# EAGLE schematic bed_prod (EAGLE 9.5.0)

## Sheet 1 of 2
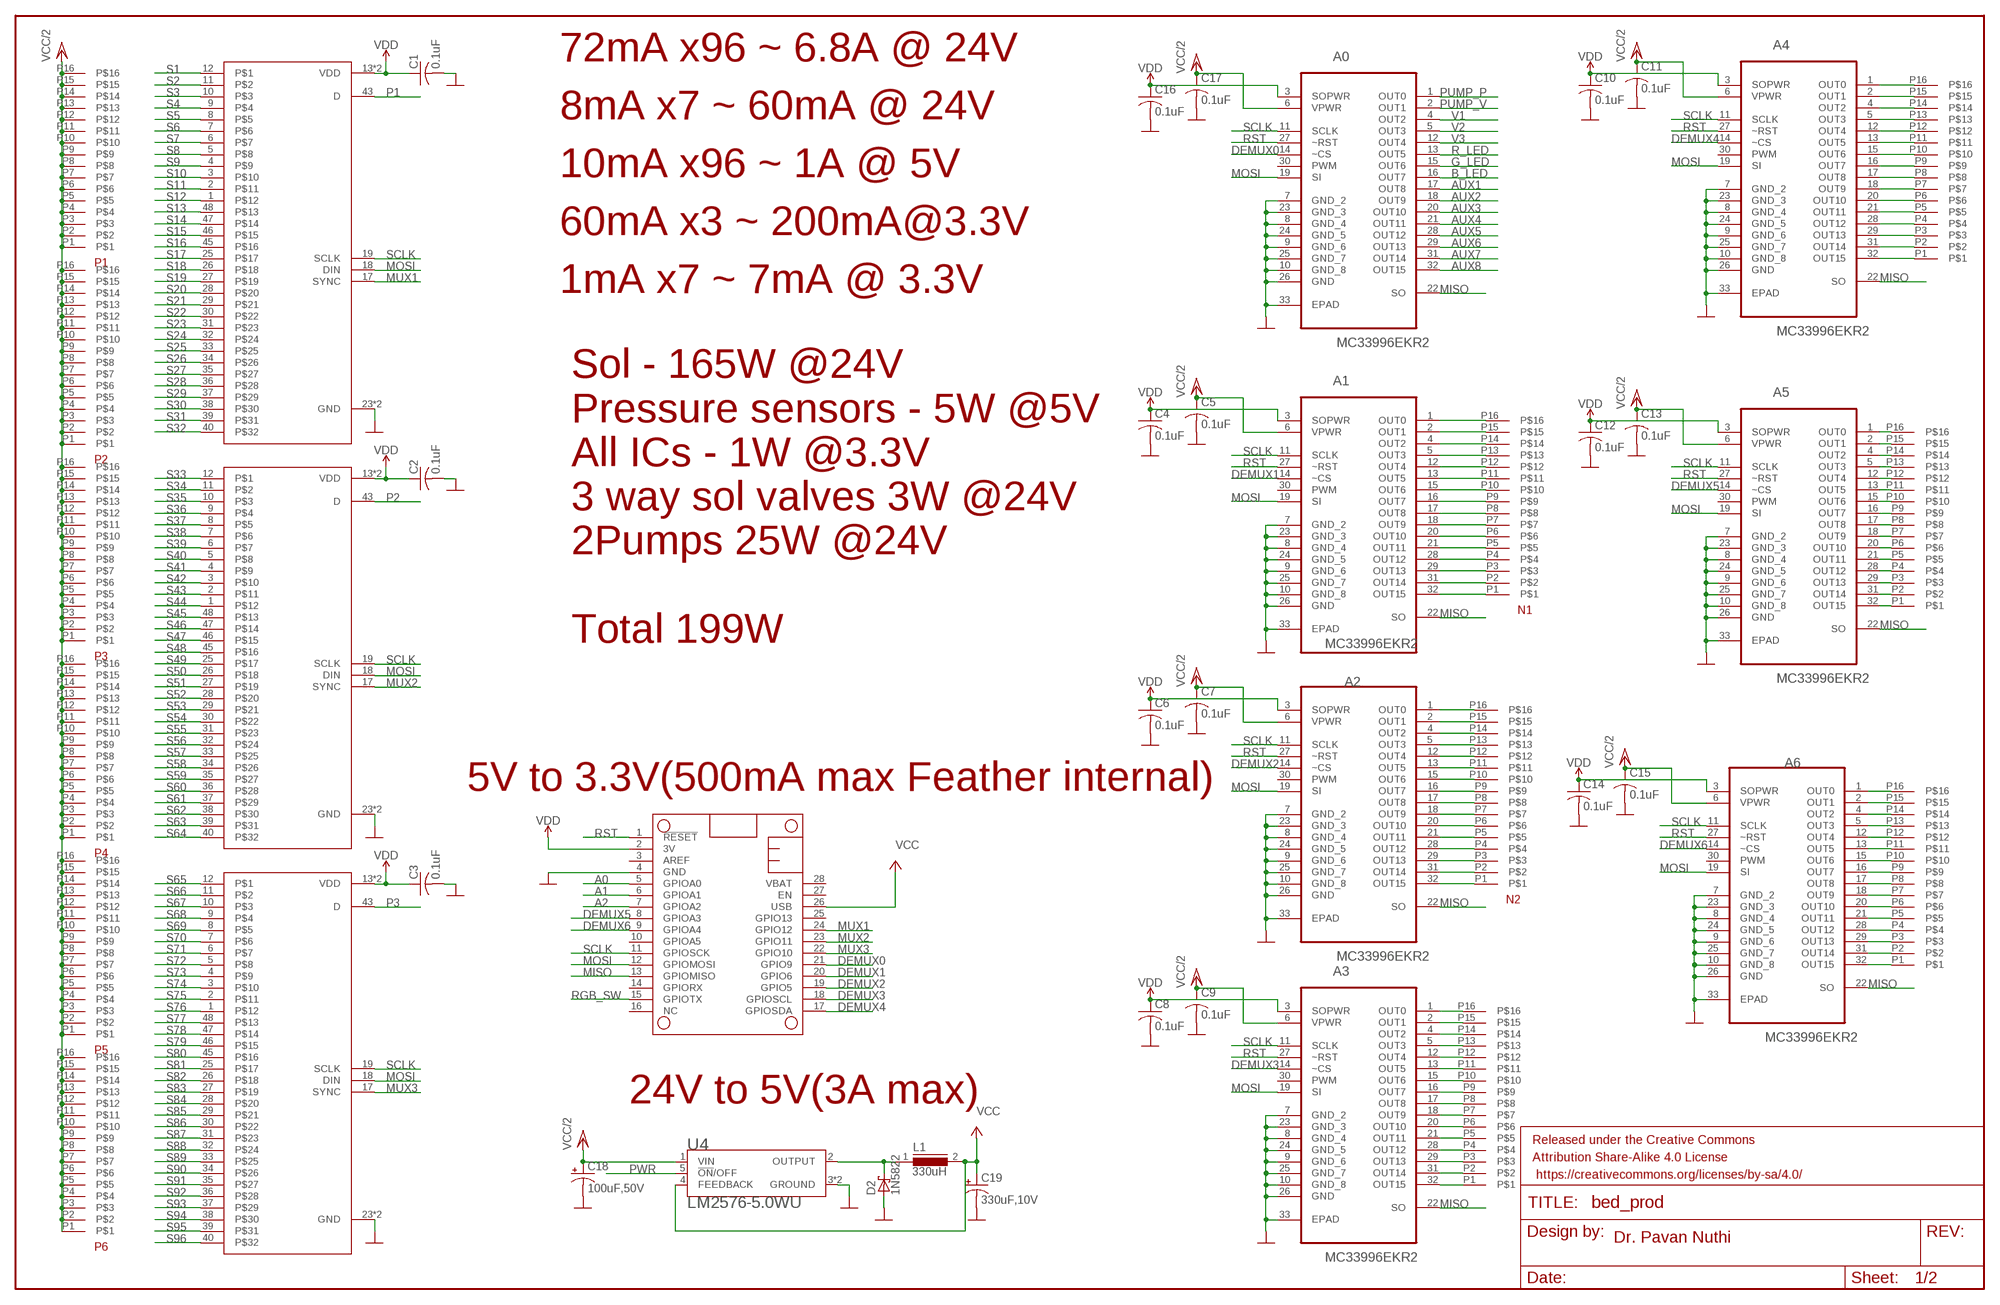
[diagram p0: schematic, sheet 1, part 1 of 2]
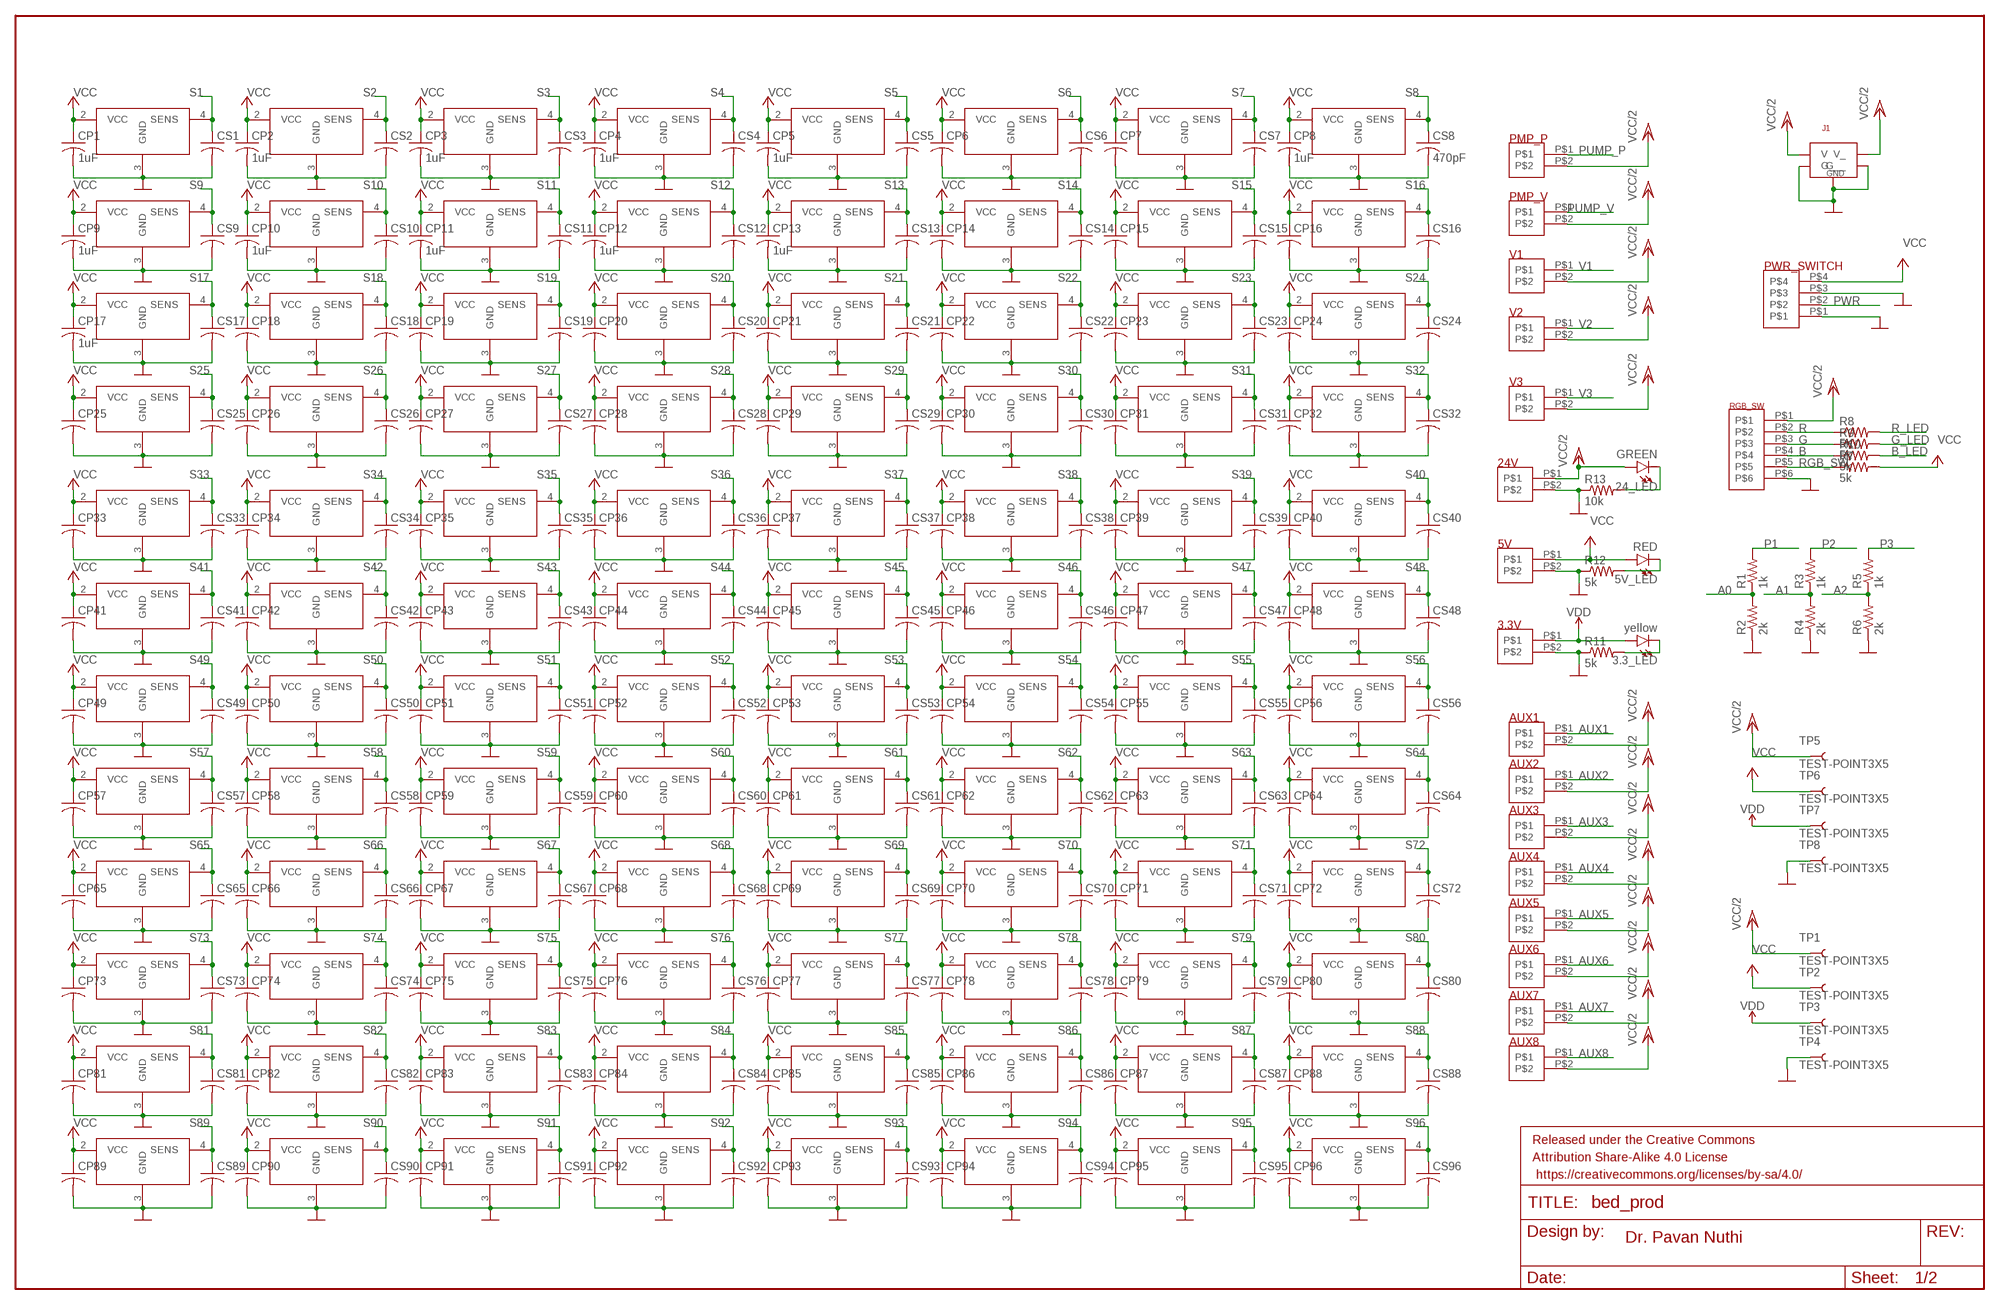
[diagram p1: schematic, sheet 1, part 2 of 2]

### Parts
3.3_LED  yellow  LED1206  [LED-1206]
3.3V  2CONN_2MM  [2CONN_2MM]
5V  2CONN_2MM  [2CONN_2MM]
5V_LED  RED  LED-RED1206  [LED-1206]
24_LED  GREEN  LED-GREEN1206  [LED-1206]
24V  2CONN_2MM  [2CONN_2MM]
A0  MC33996EKR2  [SOIC65P1030X265-32N]
A1  MC33996EKR2  [SOIC65P1030X265-32N]
A2  MC33996EKR2  [SOIC65P1030X265-32N]
A3  MC33996EKR2  [SOIC65P1030X265-32N]
A4  MC33996EKR2  [SOIC65P1030X265-32N]
A5  MC33996EKR2  [SOIC65P1030X265-32N]
A6  MC33996EKR2  [SOIC65P1030X265-32N]
AUX1  2CONN_2MM  [2CONN_2MM]
AUX2  2CONN_2MM  [2CONN_2MM]
AUX3  2CONN_2MM  [2CONN_2MM]
AUX4  2CONN_2MM  [2CONN_2MM]
AUX5  2CONN_2MM  [2CONN_2MM]
AUX6  2CONN_2MM  [2CONN_2MM]
AUX7  2CONN_2MM  [2CONN_2MM]
AUX8  2CONN_2MM  [2CONN_2MM]
C1  0.1uF  C-USC1206  [C1206]
C2  0.1uF  C-USC1206  [C1206]
C3  0.1uF  C-USC1206  [C1206]
C4  0.1uF  C-USC1206  [C1206]
C5  0.1uF  C-USC1206  [C1206]
C6  0.1uF  C-USC1206  [C1206]
C7  0.1uF  C-USC1206  [C1206]
C8  0.1uF  C-USC1206  [C1206]
C9  0.1uF  C-USC1206  [C1206]
C10  0.1uF  C-USC1206  [C1206]
C11  0.1uF  C-USC1206  [C1206]
C12  0.1uF  C-USC1206  [C1206]
C13  0.1uF  C-USC1206  [C1206]
C14  0.1uF  C-USC1206  [C1206]
C15  0.1uF  C-USC1206  [C1206]
C16  0.1uF  C-USC1206  [C1206]
C17  0.1uF  C-USC1206  [C1206]
C18  100uF,50V  CPOL-USE3.5-8  [E3,5-8]
C19  330uF,10V  CPOL-USE3.5-8  [E3,5-8]
CP1  1uF  C-USC1206  [C1206]
CP2  1uF  C-USC1206  [C1206]
CP3  1uF  C-USC1206  [C1206]
CP4  1uF  C-USC1206  [C1206]
CP5  1uF  C-USC1206  [C1206]
CP6  C-USC1206  [C1206]
CP7  C-USC1206  [C1206]
CP8  1uF  C-USC1206  [C1206]
CP9  1uF  C-USC1206  [C1206]
CP10  1uF  C-USC1206  [C1206]
CP11  1uF  C-USC1206  [C1206]
CP12  1uF  C-USC1206  [C1206]
CP13  1uF  C-USC1206  [C1206]
CP14  C-USC1206  [C1206]
CP15  C-USC1206  [C1206]
CP16  C-USC1206  [C1206]
CP17  1uF  C-USC1206  [C1206]
CP18  C-USC1206  [C1206]
CP19  C-USC1206  [C1206]
CP20  C-USC1206  [C1206]
CP21  C-USC1206  [C1206]
CP22  C-USC1206  [C1206]
CP23  C-USC1206  [C1206]
CP24  C-USC1206  [C1206]
CP25  C-USC1206  [C1206]
CP26  C-USC1206  [C1206]
CP27  C-USC1206  [C1206]
CP28  C-USC1206  [C1206]
CP29  C-USC1206  [C1206]
CP30  C-USC1206  [C1206]
CP31  C-USC1206  [C1206]
CP32  C-USC1206  [C1206]
CP33  C-USC1206  [C1206]
CP34  C-USC1206  [C1206]
CP35  C-USC1206  [C1206]
CP36  C-USC1206  [C1206]
CP37  C-USC1206  [C1206]
CP38  C-USC1206  [C1206]
CP39  C-USC1206  [C1206]
CP40  C-USC1206  [C1206]
CP41  C-USC1206  [C1206]
CP42  C-USC1206  [C1206]
CP43  C-USC1206  [C1206]
CP44  C-USC1206  [C1206]
CP45  C-USC1206  [C1206]
CP46  C-USC1206  [C1206]
CP47  C-USC1206  [C1206]
CP48  C-USC1206  [C1206]
CP49  C-USC1206  [C1206]
CP50  C-USC1206  [C1206]
CP51  C-USC1206  [C1206]
CP52  C-USC1206  [C1206]
CP53  C-USC1206  [C1206]
CP54  C-USC1206  [C1206]
CP55  C-USC1206  [C1206]
CP56  C-USC1206  [C1206]
CP57  C-USC1206  [C1206]
CP58  C-USC1206  [C1206]
CP59  C-USC1206  [C1206]
CP60  C-USC1206  [C1206]
CP61  C-USC1206  [C1206]
CP62  C-USC1206  [C1206]
CP63  C-USC1206  [C1206]
CP64  C-USC1206  [C1206]
CP65  C-USC1206  [C1206]
CP66  C-USC1206  [C1206]
CP67  C-USC1206  [C1206]
CP68  C-USC1206  [C1206]
CP69  C-USC1206  [C1206]
CP70  C-USC1206  [C1206]
CP71  C-USC1206  [C1206]
CP72  C-USC1206  [C1206]
CP73  C-USC1206  [C1206]
CP74  C-USC1206  [C1206]
CP75  C-USC1206  [C1206]
CP76  C-USC1206  [C1206]
CP77  C-USC1206  [C1206]
CP78  C-USC1206  [C1206]
CP79  C-USC1206  [C1206]
CP80  C-USC1206  [C1206]
CP81  C-USC1206  [C1206]
CP82  C-USC1206  [C1206]
CP83  C-USC1206  [C1206]
CP84  C-USC1206  [C1206]
CP85  C-USC1206  [C1206]
CP86  C-USC1206  [C1206]
CP87  C-USC1206  [C1206]
CP88  C-USC1206  [C1206]
CP89  C-USC1206  [C1206]
CP90  C-USC1206  [C1206]
CP91  C-USC1206  [C1206]
CP92  C-USC1206  [C1206]
CP93  C-USC1206  [C1206]
CP94  C-USC1206  [C1206]
CP95  C-USC1206  [C1206]
CP96  C-USC1206  [C1206]
CS1  C-USC1206  [C1206]
CS2  C-USC1206  [C1206]
CS3  C-USC1206  [C1206]
CS4  C-USC1206  [C1206]
CS5  C-USC1206  [C1206]
CS6  C-USC1206  [C1206]
CS7  C-USC1206  [C1206]
CS8  470pF  C-USC1206  [C1206]
CS9  C-USC1206  [C1206]
CS10  C-USC1206  [C1206]
CS11  C-USC1206  [C1206]
CS12  C-USC1206  [C1206]
CS13  C-USC1206  [C1206]
CS14  C-USC1206  [C1206]
CS15  C-USC1206  [C1206]
CS16  C-USC1206  [C1206]
CS17  C-USC1206  [C1206]
CS18  C-USC1206  [C1206]
CS19  C-USC1206  [C1206]
CS20  C-USC1206  [C1206]
CS21  C-USC1206  [C1206]
CS22  C-USC1206  [C1206]
CS23  C-USC1206  [C1206]
CS24  C-USC1206  [C1206]
CS25  C-USC1206  [C1206]
CS26  C-USC1206  [C1206]
CS27  C-USC1206  [C1206]
CS28  C-USC1206  [C1206]
CS29  C-USC1206  [C1206]
CS30  C-USC1206  [C1206]
CS31  C-USC1206  [C1206]
CS32  C-USC1206  [C1206]
CS33  C-USC1206  [C1206]
CS34  C-USC1206  [C1206]
CS35  C-USC1206  [C1206]
CS36  C-USC1206  [C1206]
CS37  C-USC1206  [C1206]
CS38  C-USC1206  [C1206]
CS39  C-USC1206  [C1206]
CS40  C-USC1206  [C1206]
CS41  C-USC1206  [C1206]
CS42  C-USC1206  [C1206]
CS43  C-USC1206  [C1206]
CS44  C-USC1206  [C1206]
CS45  C-USC1206  [C1206]
CS46  C-USC1206  [C1206]
CS47  C-USC1206  [C1206]
CS48  C-USC1206  [C1206]
CS49  C-USC1206  [C1206]
CS50  C-USC1206  [C1206]
CS51  C-USC1206  [C1206]
CS52  C-USC1206  [C1206]
CS53  C-USC1206  [C1206]
CS54  C-USC1206  [C1206]
CS55  C-USC1206  [C1206]
CS56  C-USC1206  [C1206]
CS57  C-USC1206  [C1206]
CS58  C-USC1206  [C1206]
CS59  C-USC1206  [C1206]
CS60  C-USC1206  [C1206]
CS61  C-USC1206  [C1206]
CS62  C-USC1206  [C1206]
CS63  C-USC1206  [C1206]
CS64  C-USC1206  [C1206]
CS65  C-USC1206  [C1206]
CS66  C-USC1206  [C1206]
CS67  C-USC1206  [C1206]
CS68  C-USC1206  [C1206]
CS69  C-USC1206  [C1206]
CS70  C-USC1206  [C1206]
CS71  C-USC1206  [C1206]
CS72  C-USC1206  [C1206]
CS73  C-USC1206  [C1206]
CS74  C-USC1206  [C1206]
CS75  C-USC1206  [C1206]
CS76  C-USC1206  [C1206]
CS77  C-USC1206  [C1206]
CS78  C-USC1206  [C1206]
CS79  C-USC1206  [C1206]
CS80  C-USC1206  [C1206]
CS81  C-USC1206  [C1206]
CS82  C-USC1206  [C1206]
CS83  C-USC1206  [C1206]
CS84  C-USC1206  [C1206]
CS85  C-USC1206  [C1206]
CS86  C-USC1206  [C1206]
CS87  C-USC1206  [C1206]
CS88  C-USC1206  [C1206]
CS89  C-USC1206  [C1206]
CS90  C-USC1206  [C1206]
CS91  C-USC1206  [C1206]
CS92  C-USC1206  [C1206]
CS93  C-USC1206  [C1206]
CS94  C-USC1206  [C1206]
CS95  C-USC1206  [C1206]
CS96  C-USC1206  [C1206]
D2  1N5822  SCHOTTKY-DIODEDO201T15  [DO201T15]
FRAME1  FRAME-LEDGER  [CREATIVE_COMMONS]
FRAME2  FRAME-LEDGER  [CREATIVE_COMMONS]
J1  KPJX-4S-S  [KYCON-KPXJ-4S]
L1  330uH  DR127  [DR127]
MS1  FEATHERWING_NODIM  [FEATHERWING_DIM]
N1  16CONN_2MM  [16CONN_2MM]
N2  16CONN_2MM  [16CONN_2MM]
N3  16CONN_2MM  [16CONN_2MM]
N4  16CONN_2MM  [16CONN_2MM]
N5  16CONN_2MM  [16CONN_2MM]
N6  16CONN_2MM  [16CONN_2MM]
P1  16CONN_2MM  [16CONN_2MM]
P2  16CONN_2MM  [16CONN_2MM]
P3  16CONN_2MM  [16CONN_2MM]
P4  16CONN_2MM  [16CONN_2MM]
P5  16CONN_2MM  [16CONN_2MM]
P6  16CONN_2MM  [16CONN_2MM]
PMP_P  2CONN_2MM  [2CONN_2MM]
PMP_V  2CONN_2MM  [2CONN_2MM]
PWR_SWITCH  4CONN_2MM  [4CONN_2MM]
R1  1k  R-US_R1206  [R1206]
R2  2k  R-US_R1206  [R1206]
R3  1k  R-US_R1206  [R1206]
R4  2k  R-US_R1206  [R1206]
R5  1k  R-US_R1206  [R1206]
R6  2k  R-US_R1206  [R1206]
R7  5k  R-US_R1206W  [R1206W]
R8  5K  R-US_R1206W  [R1206W]
R9  5k  R-US_R1206W  [R1206W]
R10  5k  R-US_R1206W  [R1206W]
R11  5k  R-US_R1206W  [R1206W]
R12  5k  R-US_R1206W  [R1206W]
R13  10k  R-US_R1206W  [R1206W]
RGB_SW  6CONN_2MM  [6CONN_2MM]
SENS1  MPX5100  [98ASB17759C]
SENS2  MPX5100  [98ASB17759C]
SENS3  MPX5100  [98ASB17759C]
SENS4  MPX5100  [98ASB17759C]
SENS5  MPX5100  [98ASB17759C]
SENS6  MPX5100  [98ASB17759C]
SENS7  MPX5100  [98ASB17759C]
SENS8  MPX5100  [98ASB17759C]
SENS9  MPX5100  [98ASB17759C]
SENS10  MPX5100  [98ASB17759C]
SENS11  MPX5100  [98ASB17759C]
SENS12  MPX5100  [98ASB17759C]
SENS13  MPX5100  [98ASB17759C]
SENS14  MPX5100  [98ASB17759C]
SENS15  MPX5100  [98ASB17759C]
SENS16  MPX5100  [98ASB17759C]
SENS17  MPX5100  [98ASB17759C]
SENS18  MPX5100  [98ASB17759C]
SENS19  MPX5100  [98ASB17759C]
SENS20  MPX5100  [98ASB17759C]
SENS21  MPX5100  [98ASB17759C]
SENS22  MPX5100  [98ASB17759C]
SENS23  MPX5100  [98ASB17759C]
SENS24  MPX5100  [98ASB17759C]
SENS25  MPX5100  [98ASB17759C]
SENS26  MPX5100  [98ASB17759C]
SENS27  MPX5100  [98ASB17759C]
SENS28  MPX5100  [98ASB17759C]
SENS29  MPX5100  [98ASB17759C]
SENS30  MPX5100  [98ASB17759C]
SENS31  MPX5100  [98ASB17759C]
SENS32  MPX5100  [98ASB17759C]
SENS33  MPX5100  [98ASB17759C]
SENS34  MPX5100  [98ASB17759C]
SENS35  MPX5100  [98ASB17759C]
SENS36  MPX5100  [98ASB17759C]
SENS37  MPX5100  [98ASB17759C]
SENS38  MPX5100  [98ASB17759C]
SENS39  MPX5100  [98ASB17759C]
SENS40  MPX5100  [98ASB17759C]
SENS41  MPX5100  [98ASB17759C]
SENS42  MPX5100  [98ASB17759C]
SENS43  MPX5100  [98ASB17759C]
SENS44  MPX5100  [98ASB17759C]
SENS45  MPX5100  [98ASB17759C]
SENS46  MPX5100  [98ASB17759C]
SENS47  MPX5100  [98ASB17759C]
SENS48  MPX5100  [98ASB17759C]
SENS49  MPX5100  [98ASB17759C]
SENS50  MPX5100  [98ASB17759C]
SENS51  MPX5100  [98ASB17759C]
SENS52  MPX5100  [98ASB17759C]
SENS53  MPX5100  [98ASB17759C]
SENS54  MPX5100  [98ASB17759C]
SENS55  MPX5100  [98ASB17759C]
SENS56  MPX5100  [98ASB17759C]
SENS57  MPX5100  [98ASB17759C]
SENS58  MPX5100  [98ASB17759C]
SENS59  MPX5100  [98ASB17759C]
SENS60  MPX5100  [98ASB17759C]
SENS61  MPX5100  [98ASB17759C]
SENS62  MPX5100  [98ASB17759C]
SENS63  MPX5100  [98ASB17759C]
SENS64  MPX5100  [98ASB17759C]
SENS65  MPX5100  [98ASB17759C]
SENS66  MPX5100  [98ASB17759C]
SENS67  MPX5100  [98ASB17759C]
SENS68  MPX5100  [98ASB17759C]
SENS69  MPX5100  [98ASB17759C]
SENS70  MPX5100  [98ASB17759C]
SENS71  MPX5100  [98ASB17759C]
SENS72  MPX5100  [98ASB17759C]
SENS73  MPX5100  [98ASB17759C]
SENS74  MPX5100  [98ASB17759C]
SENS75  MPX5100  [98ASB17759C]
SENS76  MPX5100  [98ASB17759C]
SENS77  MPX5100  [98ASB17759C]
SENS78  MPX5100  [98ASB17759C]
SENS79  MPX5100  [98ASB17759C]
SENS80  MPX5100  [98ASB17759C]
SENS81  MPX5100  [98ASB17759C]
SENS82  MPX5100  [98ASB17759C]
SENS83  MPX5100  [98ASB17759C]
SENS84  MPX5100  [98ASB17759C]
SENS85  MPX5100  [98ASB17759C]
SENS86  MPX5100  [98ASB17759C]
SENS87  MPX5100  [98ASB17759C]
SENS88  MPX5100  [98ASB17759C]
SENS89  MPX5100  [98ASB17759C]
SENS90  MPX5100  [98ASB17759C]
SENS91  MPX5100  [98ASB17759C]
SENS92  MPX5100  [98ASB17759C]
SENS93  MPX5100  [98ASB17759C]
SENS94  MPX5100  [98ASB17759C]
SENS95  MPX5100  [98ASB17759C]
SENS96  MPX5100  [98ASB17759C]
TP1  TEST-POINT3X5  [PAD.03X.05]
TP2  TEST-POINT3X5  [PAD.03X.05]
TP3  TEST-POINT3X5  [PAD.03X.05]
TP4  TEST-POINT3X5  [PAD.03X.05]
TP5  TEST-POINT3X5  [PAD.03X.05]
TP6  TEST-POINT3X5  [PAD.03X.05]
TP7  TEST-POINT3X5  [PAD.03X.05]
TP8  TEST-POINT3X5  [PAD.03X.05]
U1  ADG731  [QFP50P900X900X160-49N]
U2  ADG731  [QFP50P900X900X160-49N]
U3  ADG731  [QFP50P900X900X160-49N]
U4  LM2576-5.0WU  [DPAK6P170_1524X459L254X81N]
V1  2CONN_2MM  [2CONN_2MM]
V2  2CONN_2MM  [2CONN_2MM]
V3  2CONN_2MM  [2CONN_2MM]

### Nets
A0: MS1.5(GPIOA0) R1.1 R2.2
A1: MS1.6(GPIOA1) R3.1 R4.2
A2: MS1.7(GPIOA2) R5.1 R6.2
AUX1: A0.17(OUT8) AUX1.P$1
AUX2: A0.18(OUT9) AUX2.P$1
AUX3: A0.20(OUT10) AUX3.P$1
AUX4: A0.21(OUT11) AUX4.P$1
AUX5: A0.28(OUT12) AUX5.P$1
AUX6: A0.29(OUT13) AUX6.P$1
AUX7: A0.31(OUT14) AUX7.P$1
AUX8: A0.32(OUT15) AUX8.P$1
B: R10.1 RGB_SW.P$4
B_LED: A0.16(OUT7) R10.2
DEMUX0: A0.14(~CS) MS1.21(GPIO9)
DEMUX1: A1.14(~CS) MS1.20(GPIO6)
DEMUX2: A2.14(~CS) MS1.19(GPIO5)
DEMUX3: A3.14(~CS) MS1.18(GPIOSCL)
DEMUX4: A4.14(~CS) MS1.17(GPIOSDA)
DEMUX5: A5.14(~CS) MS1.8(GPIOA3)
DEMUX6: A6.14(~CS) MS1.9(GPIOA4)
G: R9.1 RGB_SW.P$3
G_LED: A0.15(OUT6) R9.2
GND [pwr]: 3.3V.P$2 5V.P$2 24V.P$2 A0.7(GND_2) A0.8(GND_4) A0.9(GND_6) A0.10(GND_8) A0.23(GND_3) A0.24(GND_5) A0.25(GND_7) A0.26(GND) A0.33(EPAD) A1.7(GND_2) A1.8(GND_4) A1.9(GND_6) A1.10(GND_8) A1.23(GND_3) A1.24(GND_5) A1.25(GND_7) A1.26(GND) A1.33(EPAD) A2.7(GND_2) A2.8(GND_4) A2.9(GND_6) A2.10(GND_8) A2.23(GND_3) A2.24(GND_5) A2.25(GND_7) A2.26(GND) A2.33(EPAD) A3.7(GND_2) A3.8(GND_4) A3.9(GND_6) A3.10(GND_8) A3.23(GND_3) A3.24(GND_5) A3.25(GND_7) A3.26(GND) A3.33(EPAD) A4.7(GND_2) A4.8(GND_4) A4.9(GND_6) A4.10(GND_8) A4.23(GND_3) A4.24(GND_5) A4.25(GND_7) A4.26(GND) A4.33(EPAD) A5.7(GND_2) A5.8(GND_4) A5.9(GND_6) A5.10(GND_8) A5.23(GND_3) A5.24(GND_5) A5.25(GND_7) A5.26(GND) A5.33(EPAD) A6.7(GND_2) A6.8(GND_4) A6.9(GND_6) A6.10(GND_8) A6.23(GND_3) A6.24(GND_5) A6.25(GND_7) A6.26(GND) A6.33(EPAD) C1.2 C2.2 C3.2 C4.2 C5.2 C6.2 C7.2 C8.2 C9.2 C10.2 C11.2 C12.2 C13.2 C14.2 C15.2 C16.2 C17.2 C18.- C19.- CP1.2 CP2.2 CP3.2 CP4.2 CP5.2 CP6.2 CP7.2 CP8.2 CP9.2 CP10.2 CP11.2 CP12.2 CP13.2 CP14.2 CP15.2 CP16.2 CP17.2 CP18.2 CP19.2 CP20.2 CP21.2 CP22.2 CP23.2 CP24.2 CP25.2 CP26.2 CP27.2 CP28.2 CP29.2 CP30.2 CP31.2 CP32.2 CP33.2 CP34.2 CP35.2 CP36.2 CP37.2 CP38.2 CP39.2 CP40.2 CP41.2 CP42.2 CP43.2 CP44.2 CP45.2 CP46.2 CP47.2 CP48.2 CP49.2 CP50.2 CP51.2 CP52.2 CP53.2 CP54.2 CP55.2 CP56.2 CP57.2 CP58.2 CP59.2 CP60.2 CP61.2 CP62.2 CP63.2 CP64.2 CP65.2 CP66.2 CP67.2 CP68.2 CP69.2 CP70.2 CP71.2 CP72.2 CP73.2 CP74.2 CP75.2 CP76.2 CP77.2 CP78.2 CP79.2 CP80.2 CP81.2 CP82.2 CP83.2 CP84.2 CP85.2 CP86.2 CP87.2 CP88.2 CP89.2 CP90.2 CP91.2 CP92.2 CP93.2 CP94.2 CP95.2 CP96.2 CS1.2 CS2.2 CS3.2 CS4.2 CS5.2 CS6.2 CS7.2 CS8.2 CS9.2 CS10.2 CS11.2 CS12.2 CS13.2 CS14.2 CS15.2 CS16.2 CS17.2 CS18.2 CS19.2 CS20.2 CS21.2 CS22.2 CS23.2 CS24.2 CS25.2 CS26.2 CS27.2 CS28.2 CS29.2 CS30.2 CS31.2 CS32.2 CS33.2 CS34.2 CS35.2 CS36.2 CS37.2 CS38.2 CS39.2 CS40.2 CS41.2 CS42.2 CS43.2 CS44.2 CS45.2 CS46.2 CS47.2 CS48.2 CS49.2 CS50.2 CS51.2 CS52.2 CS53.2 CS54.2 CS55.2 CS56.2 CS57.2 CS58.2 CS59.2 CS60.2 CS61.2 CS62.2 CS63.2 CS64.2 CS65.2 CS66.2 CS67.2 CS68.2 CS69.2 CS70.2 CS71.2 CS72.2 CS73.2 CS74.2 CS75.2 CS76.2 CS77.2 CS78.2 CS79.2 CS80.2 CS81.2 CS82.2 CS83.2 CS84.2 CS85.2 CS86.2 CS87.2 CS88.2 CS89.2 CS90.2 CS91.2 CS92.2 CS93.2 CS94.2 CS95.2 CS96.2 D2.A J1.GND(G) J1.GND_(G_) J1.GND__(G__) MS1.4(GND) PWR_SWITCH.P$1 PWR_SWITCH.P$3 R2.1 R4.1 R6.1 R11.1 R12.1 R13.1 RGB_SW.P$6 SENS1.3(GND) SENS2.3(GND) SENS3.3(GND) SENS4.3(GND) SENS5.3(GND) SENS6.3(GND) SENS7.3(GND) SENS8.3(GND) SENS9.3(GND) SENS10.3(GND) SENS11.3(GND) SENS12.3(GND) SENS13.3(GND) SENS14.3(GND) SENS15.3(GND) SENS16.3(GND) SENS17.3(GND) SENS18.3(GND) SENS19.3(GND) SENS20.3(GND) SENS21.3(GND) SENS22.3(GND) SENS23.3(GND) SENS24.3(GND) SENS25.3(GND) SENS26.3(GND) SENS27.3(GND) SENS28.3(GND) SENS29.3(GND) SENS30.3(GND) SENS31.3(GND) SENS32.3(GND) SENS33.3(GND) SENS34.3(GND) SENS35.3(GND) SENS36.3(GND) SENS37.3(GND) SENS38.3(GND) SENS39.3(GND) SENS40.3(GND) SENS41.3(GND) SENS42.3(GND) SENS43.3(GND) SENS44.3(GND) SENS45.3(GND) SENS46.3(GND) SENS47.3(GND) SENS48.3(GND) SENS49.3(GND) SENS50.3(GND) SENS51.3(GND) SENS52.3(GND) SENS53.3(GND) SENS54.3(GND) SENS55.3(GND) SENS56.3(GND) SENS57.3(GND) SENS58.3(GND) SENS59.3(GND) SENS60.3(GND) SENS61.3(GND) SENS62.3(GND) SENS63.3(GND) SENS64.3(GND) SENS65.3(GND) SENS66.3(GND) SENS67.3(GND) SENS68.3(GND) SENS69.3(GND) SENS70.3(GND) SENS71.3(GND) SENS72.3(GND) SENS73.3(GND) SENS74.3(GND) SENS75.3(GND) SENS76.3(GND) SENS77.3(GND) SENS78.3(GND) SENS79.3(GND) SENS80.3(GND) SENS81.3(GND) SENS82.3(GND) SENS83.3(GND) SENS84.3(GND) SENS85.3(GND) SENS86.3(GND) SENS87.3(GND) SENS88.3(GND) SENS89.3(GND) SENS90.3(GND) SENS91.3(GND) SENS92.3(GND) SENS93.3(GND) SENS94.3(GND) SENS95.3(GND) SENS96.3(GND) TP4.P$1 TP8.P$1 U1.23(GND) U1.24(GND) U2.23(GND) U2.24(GND) U3.23(GND) U3.24(GND) U4.3(GROUND) U4.6(GROUND)
MISO: A0.22(SO) A1.22(SO) A2.22(SO) A3.22(SO) A4.22(SO) A5.22(SO) A6.22(SO) MS1.13(GPIOMISO)
MOSI: A0.19(SI) A1.19(SI) A2.19(SI) A3.19(SI) A4.19(SI) A5.19(SI) A6.19(SI) MS1.12(GPIOMOSI) U1.18(DIN) U2.18(DIN) U3.18(DIN)
MUX1: MS1.24(GPIO12) U1.17(SYNC)
MUX2: MS1.23(GPIO11) U2.17(SYNC)
MUX3: MS1.22(GPIO10) U3.17(SYNC)
N$1: D2.C L1.1 U4.2(OUTPUT)
N$2: A5.1(OUT0) N5.P16
N$3: A5.2(OUT1) N5.P15
N$4: A5.4(OUT2) N5.P14
N$5: A5.5(OUT3) N5.P13
N$6: A5.12(OUT4) N5.P12
N$7: A5.13(OUT5) N5.P11
N$8: A5.15(OUT6) N5.P10
N$9: A5.16(OUT7) N5.P9
N$10: A5.17(OUT8) N5.P8
N$11: A5.18(OUT9) N5.P7
N$12: A5.20(OUT10) N5.P6
N$13: A5.21(OUT11) N5.P5
N$14: A5.28(OUT12) N5.P4
N$15: A5.29(OUT13) N5.P3
N$16: A5.31(OUT14) N5.P2
N$17: A5.32(OUT15) N5.P1
N$18: A6.1(OUT0) N6.P16
N$19: A6.2(OUT1) N6.P15
N$20: A6.4(OUT2) N6.P14
N$21: A6.5(OUT3) N6.P13
N$22: A6.12(OUT4) N6.P12
N$23: A6.13(OUT5) N6.P11
N$24: A6.15(OUT6) N6.P10
N$25: A6.16(OUT7) N6.P9
N$26: A6.17(OUT8) N6.P8
N$27: A6.18(OUT9) N6.P7
N$28: A6.20(OUT10) N6.P6
N$29: A6.21(OUT11) N6.P5
N$30: A6.28(OUT12) N6.P4
N$31: A6.29(OUT13) N6.P3
N$32: A6.31(OUT14) N6.P2
N$33: A6.32(OUT15) N6.P1
N$34: A4.1(OUT0) N4.P16
N$35: A4.2(OUT1) N4.P15
N$36: A4.4(OUT2) N4.P14
N$37: A4.5(OUT3) N4.P13
N$38: A4.12(OUT4) N4.P12
N$39: A4.13(OUT5) N4.P11
N$40: A4.15(OUT6) N4.P10
N$41: A4.16(OUT7) N4.P9
N$42: A4.17(OUT8) N4.P8
N$43: A4.18(OUT9) N4.P7
N$44: A4.20(OUT10) N4.P6
N$45: A4.21(OUT11) N4.P5
N$46: A4.28(OUT12) N4.P4
N$47: A4.29(OUT13) N4.P3
N$48: A4.31(OUT14) N4.P2
N$49: A4.32(OUT15) N4.P1
N$50: A3.1(OUT0) N3.P16
N$51: A3.2(OUT1) N3.P15
N$52: A3.4(OUT2) N3.P14
N$53: A3.5(OUT3) N3.P13
N$54: A3.12(OUT4) N3.P12
N$55: A3.13(OUT5) N3.P11
N$56: A3.15(OUT6) N3.P10
N$57: A3.16(OUT7) N3.P9
N$58: A3.17(OUT8) N3.P8
N$59: A3.18(OUT9) N3.P7
N$60: A3.20(OUT10) N3.P6
N$61: A3.21(OUT11) N3.P5
N$62: A3.28(OUT12) N3.P4
N$63: A3.29(OUT13) N3.P3
N$64: A3.31(OUT14) N3.P2
N$65: A1.1(OUT0) N1.P16
N$66: A1.2(OUT1) N1.P15
N$67: A1.4(OUT2) N1.P14
N$68: A1.5(OUT3) N1.P13
N$69: A1.12(OUT4) N1.P12
N$70: A1.13(OUT5) N1.P11
N$71: A1.15(OUT6) N1.P10
N$72: A1.16(OUT7) N1.P9
N$73: A1.17(OUT8) N1.P8
N$74: A1.18(OUT9) N1.P7
N$75: A1.20(OUT10) N1.P6
N$76: A1.21(OUT11) N1.P5
N$77: A1.28(OUT12) N1.P4
N$78: A1.29(OUT13) N1.P3
N$79: A1.31(OUT14) N1.P2
N$80: A1.32(OUT15) N1.P1
N$81: A2.1(OUT0) N2.P16
N$82: A2.2(OUT1) N2.P15
N$83: A2.4(OUT2) N2.P14
N$84: A2.5(OUT3) N2.P13
N$85: A2.12(OUT4) N2.P12
N$86: A2.13(OUT5) N2.P11
N$87: A2.15(OUT6) N2.P10
N$88: A2.16(OUT7) N2.P9
N$89: A2.17(OUT8) N2.P8
N$90: A2.18(OUT9) N2.P7
N$91: A2.20(OUT10) N2.P6
N$92: A2.21(OUT11) N2.P5
N$93: A2.28(OUT12) N2.P4
N$94: A2.29(OUT13) N2.P3
N$95: A2.31(OUT14) N2.P2
N$96: A2.32(OUT15) N2.P1
N$97: 3.3_LED.C R11.2
N$98: 24_LED.C R13.2
N$99: 5V_LED.C R12.2
N$136: A3.32(OUT15) N3.P1
P1: R1.2 U1.43(D)
P2: R3.2 U2.43(D)
P3: R5.2 U3.43(D)
PUMP_P: A0.1(OUT0) PMP_P.P$1
PUMP_V: A0.2(OUT1) PMP_V.P$1
PWR: PWR_SWITCH.P$2 U4.5(!ON!/OFF)
R: R8.1 RGB_SW.P$2
R_LED: A0.13(OUT5) R8.2
RGB_SW: MS1.15(GPIOTX) R7.1 RGB_SW.P$5
RST: A0.27(~RST) A1.27(~RST) A2.27(~RST) A3.27(~RST) A4.27(~RST) A5.27(~RST) A6.27(~RST) MS1.1(!RESET)
S1: CS1.1 SENS1.4(SENS) U1.12
S2: CS2.1 SENS2.4(SENS) U1.11
S3: CS3.1 SENS3.4(SENS) U1.10
S4: CS4.1 SENS4.4(SENS) U1.9
S5: CS5.1 SENS5.4(SENS) U1.8
S6: CS6.1 SENS6.4(SENS) U1.7
S7: CS7.1 SENS7.4(SENS) U1.6
S8: CS8.1 SENS8.4(SENS) U1.5
S9: CS9.1 SENS9.4(SENS) U1.4
S10: CS10.1 SENS10.4(SENS) U1.3
S11: CS11.1 SENS11.4(SENS) U1.2
S12: CS12.1 SENS12.4(SENS) U1.1
S13: CS13.1 SENS13.4(SENS) U1.48
S14: CS14.1 SENS14.4(SENS) U1.47
S15: CS15.1 SENS15.4(SENS) U1.46
S16: CS16.1 SENS16.4(SENS) U1.45
S17: CS17.1 SENS17.4(SENS) U1.25
S18: CS18.1 SENS18.4(SENS) U1.26
S19: CS19.1 SENS19.4(SENS) U1.27
S20: CS20.1 SENS20.4(SENS) U1.28
S21: CS21.1 SENS21.4(SENS) U1.29
S22: CS22.1 SENS22.4(SENS) U1.30
S23: CS23.1 SENS23.4(SENS) U1.31
S24: CS24.1 SENS24.4(SENS) U1.32
S25: CS25.1 SENS25.4(SENS) U1.33
S26: CS26.1 SENS26.4(SENS) U1.34
S27: CS27.1 SENS27.4(SENS) U1.35
S28: CS28.1 SENS28.4(SENS) U1.36
S29: CS29.1 SENS29.4(SENS) U1.37
S30: CS30.1 SENS30.4(SENS) U1.38
S31: CS31.1 SENS31.4(SENS) U1.39
S32: CS32.1 SENS32.4(SENS) U1.40
S33: CS33.1 SENS33.4(SENS) U2.12
S34: CS34.1 SENS34.4(SENS) U2.11
S35: CS35.1 SENS35.4(SENS) U2.10
S36: CS36.1 SENS36.4(SENS) U2.9
S37: CS37.1 SENS37.4(SENS) U2.8
S38: CS38.1 SENS38.4(SENS) U2.7
S39: CS39.1 SENS39.4(SENS) U2.6
S40: CS40.1 SENS40.4(SENS) U2.5
S41: CS41.1 SENS41.4(SENS) U2.4
S42: CS42.1 SENS42.4(SENS) U2.3
S43: CS43.1 SENS43.4(SENS) U2.2
S44: CS44.1 SENS44.4(SENS) U2.1
S45: CS45.1 SENS45.4(SENS) U2.48
S46: CS46.1 SENS46.4(SENS) U2.47
S47: CS47.1 SENS47.4(SENS) U2.46
S48: CS48.1 SENS48.4(SENS) U2.45
S49: CS49.1 SENS49.4(SENS) U2.25
S50: CS50.1 SENS50.4(SENS) U2.26
S51: CS51.1 SENS51.4(SENS) U2.27
S52: CS52.1 SENS52.4(SENS) U2.28
S53: CS53.1 SENS53.4(SENS) U2.29
S54: CS54.1 SENS54.4(SENS) U2.30
S55: CS55.1 SENS55.4(SENS) U2.31
S56: CS56.1 SENS56.4(SENS) U2.32
S57: CS57.1 SENS57.4(SENS) U2.33
S58: CS58.1 SENS58.4(SENS) U2.34
S59: CS59.1 SENS59.4(SENS) U2.35
S60: CS60.1 SENS60.4(SENS) U2.36
S61: CS61.1 SENS61.4(SENS) U2.37
S62: CS62.1 SENS62.4(SENS) U2.38
S63: CS63.1 SENS63.4(SENS) U2.39
S64: CS64.1 SENS64.4(SENS) U2.40
S65: CS65.1 SENS65.4(SENS) U3.12
S66: CS66.1 SENS66.4(SENS) U3.11
S67: CS67.1 SENS67.4(SENS) U3.10
S68: CS68.1 SENS68.4(SENS) U3.9
S69: CS69.1 SENS69.4(SENS) U3.8
S70: CS70.1 SENS70.4(SENS) U3.7
S71: CS71.1 SENS71.4(SENS) U3.6
S72: CS72.1 SENS72.4(SENS) U3.5
S73: CS73.1 SENS73.4(SENS) U3.4
S74: CS74.1 SENS74.4(SENS) U3.3
S75: CS75.1 SENS75.4(SENS) U3.2
S76: CS76.1 SENS76.4(SENS) U3.1
S77: CS77.1 SENS77.4(SENS) U3.48
S78: CS78.1 SENS78.4(SENS) U3.47
S79: CS79.1 SENS79.4(SENS) U3.46
S80: CS80.1 SENS80.4(SENS) U3.45
S81: CS81.1 SENS81.4(SENS) U3.25
S82: CS82.1 SENS82.4(SENS) U3.26
S83: CS83.1 SENS83.4(SENS) U3.27
S84: CS84.1 SENS84.4(SENS) U3.28
S85: CS85.1 SENS85.4(SENS) U3.29
S86: CS86.1 SENS86.4(SENS) U3.30
S87: CS87.1 SENS87.4(SENS) U3.31
S88: CS88.1 SENS88.4(SENS) U3.32
S89: CS89.1 SENS89.4(SENS) U3.33
S90: CS90.1 SENS90.4(SENS) U3.34
S91: CS91.1 SENS91.4(SENS) U3.35
S92: CS92.1 SENS92.4(SENS) U3.36
S93: CS93.1 SENS93.4(SENS) U3.37
S94: CS94.1 SENS94.4(SENS) U3.38
S95: CS95.1 SENS95.4(SENS) U3.39
S96: CS96.1 SENS96.4(SENS) U3.40
SCLK: A0.11(SCLK) A1.11(SCLK) A2.11(SCLK) A3.11(SCLK) A4.11(SCLK) A5.11(SCLK) A6.11(SCLK) MS1.11(GPIOSCK) U1.19(SCLK) U2.19(SCLK) U3.19(SCLK)
V1: A0.4(OUT2) V1.P$1
V2: A0.5(OUT3) V2.P$1
V3: A0.12(OUT4) V3.P$1
VCC [pwr]: 5V.P$1 5V_LED.A C19.+ CP1.1 CP2.1 CP3.1 CP4.1 CP5.1 CP6.1 CP7.1 CP8.1 CP9.1 CP10.1 CP11.1 CP12.1 CP13.1 CP14.1 CP15.1 CP16.1 CP17.1 CP18.1 CP19.1 CP20.1 CP21.1 CP22.1 CP23.1 CP24.1 CP25.1 CP26.1 CP27.1 CP28.1 CP29.1 CP30.1 CP31.1 CP32.1 CP33.1 CP34.1 CP35.1 CP36.1 CP37.1 CP38.1 CP39.1 CP40.1 CP41.1 CP42.1 CP43.1 CP44.1 CP45.1 CP46.1 CP47.1 CP48.1 CP49.1 CP50.1 CP51.1 CP52.1 CP53.1 CP54.1 CP55.1 CP56.1 CP57.1 CP58.1 CP59.1 CP60.1 CP61.1 CP62.1 CP63.1 CP64.1 CP65.1 CP66.1 CP67.1 CP68.1 CP69.1 CP70.1 CP71.1 CP72.1 CP73.1 CP74.1 CP75.1 CP76.1 CP77.1 CP78.1 CP79.1 CP80.1 CP81.1 CP82.1 CP83.1 CP84.1 CP85.1 CP86.1 CP87.1 CP88.1 CP89.1 CP90.1 CP91.1 CP92.1 CP93.1 CP94.1 CP95.1 CP96.1 L1.2 MS1.26(USB) PWR_SWITCH.P$4 R7.2 SENS1.2(VCC) SENS2.2(VCC) SENS3.2(VCC) SENS4.2(VCC) SENS5.2(VCC) SENS6.2(VCC) SENS7.2(VCC) SENS8.2(VCC) SENS9.2(VCC) SENS10.2(VCC) SENS11.2(VCC) SENS12.2(VCC) SENS13.2(VCC) SENS14.2(VCC) SENS15.2(VCC) SENS16.2(VCC) SENS17.2(VCC) SENS18.2(VCC) SENS19.2(VCC) SENS20.2(VCC) SENS21.2(VCC) SENS22.2(VCC) SENS23.2(VCC) SENS24.2(VCC) SENS25.2(VCC) SENS26.2(VCC) SENS27.2(VCC) SENS28.2(VCC) SENS29.2(VCC) SENS30.2(VCC) SENS31.2(VCC) SENS32.2(VCC) SENS33.2(VCC) SENS34.2(VCC) SENS35.2(VCC) SENS36.2(VCC) SENS37.2(VCC) SENS38.2(VCC) SENS39.2(VCC) SENS40.2(VCC) SENS41.2(VCC) SENS42.2(VCC) SENS43.2(VCC) SENS44.2(VCC) SENS45.2(VCC) SENS46.2(VCC) SENS47.2(VCC) SENS48.2(VCC) SENS49.2(VCC) SENS50.2(VCC) SENS51.2(VCC) SENS52.2(VCC) SENS53.2(VCC) SENS54.2(VCC) SENS55.2(VCC) SENS56.2(VCC) SENS57.2(VCC) SENS58.2(VCC) SENS59.2(VCC) SENS60.2(VCC) SENS61.2(VCC) SENS62.2(VCC) SENS63.2(VCC) SENS64.2(VCC) SENS65.2(VCC) SENS66.2(VCC) SENS67.2(VCC) SENS68.2(VCC) SENS69.2(VCC) SENS70.2(VCC) SENS71.2(VCC) SENS72.2(VCC) SENS73.2(VCC) SENS74.2(VCC) SENS75.2(VCC) SENS76.2(VCC) SENS77.2(VCC) SENS78.2(VCC) SENS79.2(VCC) SENS80.2(VCC) SENS81.2(VCC) SENS82.2(VCC) SENS83.2(VCC) SENS84.2(VCC) SENS85.2(VCC) SENS86.2(VCC) SENS87.2(VCC) SENS88.2(VCC) SENS89.2(VCC) SENS90.2(VCC) SENS91.2(VCC) SENS92.2(VCC) SENS93.2(VCC) SENS94.2(VCC) SENS95.2(VCC) SENS96.2(VCC) TP2.P$1 TP6.P$1 U4.4(FEEDBACK)
VCC/2: 24_LED.A 24V.P$1 A0.6(VPWR) A1.6(VPWR) A2.6(VPWR) A3.6(VPWR) A4.6(VPWR) A5.6(VPWR) A6.6(VPWR) AUX1.P$2 AUX2.P$2 AUX3.P$2 AUX4.P$2 AUX5.P$2 AUX6.P$2 AUX7.P$2 AUX8.P$2 C5.1 C7.1 C9.1 C11.1 C13.1 C15.1 C17.1 C18.+ J1.V+(V) J1.V++(V_) P1.P1 P1.P2 P1.P3 P1.P4 P1.P5 P1.P6 P1.P7 P1.P8 P1.P9 P1.P10 P1.P11 P1.P12 P1.P13 P1.P14 P1.P15 P1.P16 P2.P1 P2.P2 P2.P3 P2.P4 P2.P5 P2.P6 P2.P7 P2.P8 P2.P9 P2.P10 P2.P11 P2.P12 P2.P13 P2.P14 P2.P15 P2.P16 P3.P1 P3.P2 P3.P3 P3.P4 P3.P5 P3.P6 P3.P7 P3.P8 P3.P9 P3.P10 P3.P11 P3.P12 P3.P13 P3.P14 P3.P15 P3.P16 P4.P1 P4.P2 P4.P3 P4.P4 P4.P5 P4.P6 P4.P7 P4.P8 P4.P9 P4.P10 P4.P11 P4.P12 P4.P13 P4.P14 P4.P15 P4.P16 P5.P1 P5.P2 P5.P3 P5.P4 P5.P5 P5.P6 P5.P7 P5.P8 P5.P9 P5.P10 P5.P11 P5.P12 P5.P13 P5.P14 P5.P15 P5.P16 P6.P1 P6.P2 P6.P3 P6.P4 P6.P5 P6.P6 P6.P7 P6.P8 P6.P9 P6.P10 P6.P11 P6.P12 P6.P13 P6.P14 P6.P15 P6.P16 PMP_P.P$2 PMP_V.P$2 RGB_SW.P$1 TP1.P$1 TP5.P$1 U4.1(VIN) V1.P$2 V2.P$2 V3.P$2
VDD [pwr]: 3.3_LED.A 3.3V.P$1 A0.3(SOPWR) A1.3(SOPWR) A2.3(SOPWR) A3.3(SOPWR) A4.3(SOPWR) A5.3(SOPWR) A6.3(SOPWR) C1.1 C2.1 C3.1 C4.1 C6.1 C8.1 C10.1 C12.1 C14.1 C16.1 MS1.2(3V) TP3.P$1 TP7.P$1 U1.13(VDD) U1.14(VDD) U2.13(VDD) U2.14(VDD) U3.13(VDD) U3.14(VDD)
Unconnected: A0.30(PWM) A1.30(PWM) A2.30(PWM) A3.30(PWM) A4.30(PWM) A5.30(PWM) A6.30(PWM) MS1.3(AREF) MS1.10(GPIOA5) MS1.14(GPIORX) MS1.16(NC) MS1.25(GPIO13) MS1.27(EN) MS1.28(VBAT)

### Notes on the sheet
- 72mA x96 ~ 6.8A @ 24V
- 8mA x7 ~ 60mA @ 24V
- 10mA x96 ~ 1A @ 5V
- 60mA x3 ~ 200mA@3.3V
- 1mA x7 ~ 7mA @ 3.3V
- Sol - 165W @24V
  Pressure sensors - 5W @5V
  All ICs - 1W @3.3V
  3 way sol valves 3W @24V
  2Pumps 25W @24V
  
  Total 199W
- 5V to 3.3V(500mA max Feather internal)
- 24V to 5V(3A max)
- Dr. Pavan Nuthi | Dr. Pavan Nuthi

## Sheet 2 of 2

## Library data of the parts
3.3_LED = SparkFun-LED:LED: LED (Generic) Standard schematic elements and footprints for 5mm, 3mm, 1206, and 0603 sized LEDs. Generic LEDs with no color specified.
3.3V 5V 24V AUX1-AUX8 PMP_P PMP_V V1-V3 = bed_components:2CONN_2MM
5V_LED = SparkFun-LED:LED-RED: Red SMD LED Used in manufacturing of most products at SparkFun Packages: 0603 - SMD 0603 package [Product Link] <http://docs.avagotech.com/docs/AV02-0551EN> 0603 SMART - SMD 0603 SMART package ( more efficient and expensive)[Product Link] <http://www.osram-os.com/Graphics/XPic2/00077099_0.pdf> 1206 - SMD1206 package [Product Link] <https://www.sparkfun.com/datasheets/DevTools/LilyPad/Q150OVS4.pdff> SparkFun Products: Pro Mini 328 -5V <https://www.sparkfun.com/products/821> RedBoard <https://www.sparkfun.com/products/12757> IOIO-OTG <https://www.sparkfun.com/products/13613>; PROD_ID: DIO-09912
24_LED = SparkFun-LED:LED-GREEN: Green SMD LED Used in manufacturing of various products at SparkFun Packages: 0603 - SMD 0603 package [Product Link] <http://www.futureelectronics.com/en/technologies/semiconductors/optoelectronics/leds/Pages/9894312-LTST-C190GKT.aspx?CrossPart=HSMG-C190&IM=0> LilyPad 1206 - SMD1206 LilyPad package [Product Link] <http://www.futureelectronics.com/en/Technologies/Product.aspx?ProductID=IN150NGHARVATEKCORPORATION2049943&IM=0> 1206 - SMD1206 package [Product Link] <http://www.futureelectronics.com/en/technologies/semiconductors/optoelectronics/leds/Pages/8315665-LTST-C150KGKT.aspx?IM=0> 1206 Bottom Mount -SMD 1206 Bottom Mount [Product Link] <http://www.digikey.com/product-detail/en/lite-on-inc/LTST-C230KGKT/160-1456-1-ND/386854> SparkFun Products: Pro Mini 328 -5V <https://www.sparkfun.com/products/821> RedBoard <https://www.sparkfun.com/products/12757> MP3 Trigger <https://www.sparkfun.com/products/13720> Makey Makey <https://www.sparkfun.com/products/11076>; PROD_ID: DIO-00862
A0 A1-A6 = bed_components:MC33996EKR2: 16 Output Switch; AVAILABILITY: Unavailable; DESCRIPTION: 1000; MF: NXP USA; MP: MC33996EKR2; PACKAGE: SOIC-32 Freescale Semiconductor; PRICE: None
C1-C17 CP1-CP96 CS1-CS96 = adafruit:C-US: CAPACITOR, American symbol
C18 C19 = adafruit:CPOL-US: POLARIZED CAPACITOR, American symbol
D2 = adafruit:SCHOTTKY-DIODE: Schottky Diode
FRAME1 = SparkFun-Aesthetics:FRAME-LEDGER: Schematic Frame - Ledger Standard 11x14 US Ledger frame; SPICEPREFIX: X
FRAME2 = SparkFun-Aesthetics:FRAME-LEDGER: Schematic Frame - Ledger Standard 11x14 US Ledger frame
J1 = bed_components:KPJX-4S-S
L1 = inductors:DR127: High Power Density, High Efficiency, Shielded Inductors Source: coiltronics_dr_series.pdf; SPICEPREFIX: L
MS1 = adafruit:FEATHERWING
N1-N6 P1-P6 = bed_components:16CONN_2MM
PWR_SWITCH = bed_components:4CONN_2MM
R1-R13 = adafruit:R-US_: RESISTOR, American symbol
RGB_SW = bed_components:6CONN_2MM
SENS1-SENS96 = bed_components:MPX5100
TP1-TP8 = SparkFun-Connectors:TEST-POINT: SparkFun Test Points Bare copper test points for troubleshooting or In-Circuit-Testing. These are used by our Production team for verifying production board runs using pogo-pins on test beds. SparkFun Products: SparkFun LSM9DS1 Breakout <https://www.sparkfun.com/products/13284> SparkFun PSOC <https://www.sparkfun.com/products/13714> SparkFun Load Cell Amplifier <https://www.sparkfun.com/products/13879>
U1-U3 = bed_components:ADG731; A1_MIN: 0.15; A_MAX: 1.6; B_MAX: 0.27; B_MIN: 0.17; B_NOM: 0.22; D1_MAX: 7.1; D1_MIN: 6.9; D1_NOM: 7.0; D2_NOM: 0.0; D_MAX: 9.1; D_MIN: 8.9; D_NOM: 9.0; E1_MAX: 7.1; E1_MIN: 6.9; E1_NOM: 7.0; E2_NOM: 0.0; ENOM: 0.5; E_MAX: 9.1; E_MIN: 8.9; E_NOM: 9.0; L_MAX: 0.75; L_MIN: 0.45; L_NOM: 0.6; MANUFACTURER: Maxim Integrated; PIN_COUNT_D: 12.0; PIN_COUNT_E: 12.0; SNAPEDA_PACKAGE_ID: 70996; STANDARD: IPC 7351B
U4 = bed_components:LM2576-5.0WU: LM2576 Series 40 V 52 kHz 3 A Simple Step-Down Buck Regulator - TO-263-5; AVAILABILITY: Unavailable; DESCRIPTION: LM2576 Series 40 V 52 kHz 3 A Simple Step-Down Buck Regulator - TO-263-5; MF: Microchip; MP: LM2576-5.0WU; PACKAGE: TO-263-5 Microchip; PRICE: None

## Module DFG
Ports: 

### Library data of the parts

## Net classes
0 default: width 0.203 mm
1 pwr: width 0.406 mm
2 Vcc: width 1.27 mm